# Altium schematic sheet connector.SchDoc
size A; SheetNumber: 3; SheetTotal: 3
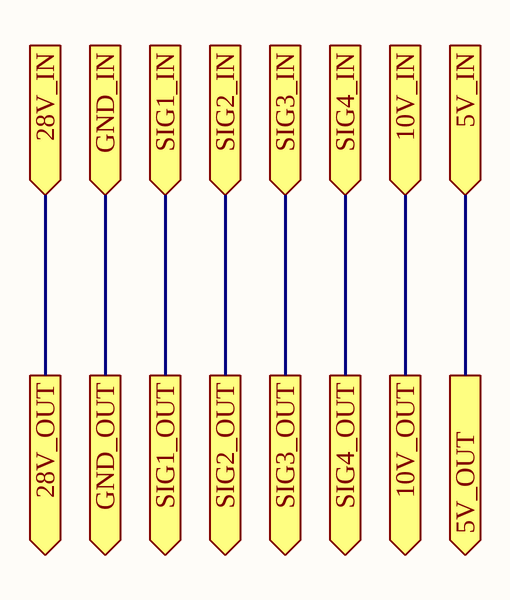
[diagram p0: connector.SchDoc]

## Ports
5V_IN (in), 5V_OUT (out), 10V_IN (in), 10V_OUT (out), 28V_IN (in), 28V_OUT (out), GND_IN (in), GND_OUT (out), SIG1_IN (in), SIG1_OUT (out), SIG2_IN (in), SIG2_OUT (out), SIG3_IN (in), SIG3_OUT (out), SIG4_IN (in), SIG4_OUT (out)

## Nets
5V_IN: port 5V_IN, port 5V_OUT
10V_IN: port 10V_IN, port 10V_OUT
28V_IN: port 28V_IN, port 28V_OUT
GND_IN: port GND_IN, port GND_OUT
SIG1_IN: port SIG1_IN, port SIG1_OUT
SIG2_IN: port SIG2_IN, port SIG2_OUT
SIG3_IN: port SIG3_IN, port SIG3_OUT
SIG4_IN: port SIG4_IN, port SIG4_OUT